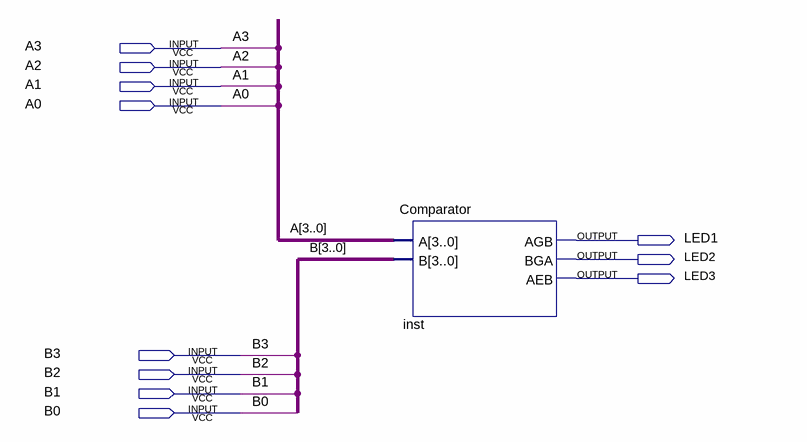
[diagram p0: schematic sheet]
// Quartus schematic ComparatorTest.bdf as structural Verilog: 1 symbols, 11 pins
module ComparatorTest (
  input  A3,
  input  A2,
  input  A1,
  input  A0,
  input  B3,
  input  B2,
  input  B1,
  input  B0,
  output LED1,
  output LED2,
  output LED3
);

  Comparator inst (.A({A3, A2, A1, A0}), .B({B3, B2, B1, B0}), .AGB(LED1), .BGA(LED2), .AEB(LED3));
endmodule
